# Altium schematic sheet Sheet1.SchDoc
size A; SheetNumber: 1; SheetTotal: 1
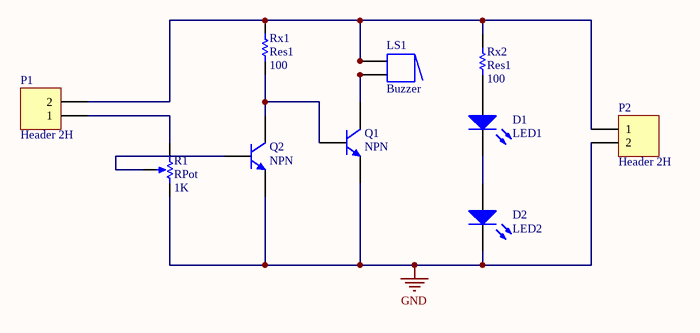
[diagram p0: Sheet1.SchDoc]

## Parts
D1  LED1  [LED-1]
D2  LED2  [LED-1]
LS1  Buzzer  [ABSM-1574]
P1  Header 2H  [HDR1X2H]
P2  Header 2H  [HDR1X2H]
Q1  NPN  [TO-226-AA]
Q2  NPN  [TO-226-AA]
R1  RPot  value 1K  [VR5]
Rx1  Res1  value 100  [AXIAL-0.1-RES]
Rx2  Res1  value 100  [AXIAL-0.1-RES]

## Nets
GND: D2.2(K) P2.2 Q1.3(E) Q2.3(E) R1.2(BOT)
NetD1_1: D1.1(A) Rx2.1
NetD1_2: D1.2(K) D2.1(A)
NetLS1_1: LS1.1 LS1.1A P1.2 P2.1 Rx1.2 Rx2.2
NetLS1_2: LS1.2 LS1.2A Q1.1(C)
NetP1_1: P1.1 R1.1(TOP)
NetQ1_2: Q1.2(B) Q2.1(C) Rx1.1
NetQ2_2: Q2.2(B) R1.3(TAP)

## Library data of the parts
D1 D2 = LED1: Typical RED GaAs LED; Published: 8-Jun-2000; LatestRevisionDate: 08-Jul-2005; LatestRevisionNote: Mech Layer 1 removed.; PackageReference: LED-1; Publisher: Altium Limited; PackageDescription: LED; 2 Leads
LS1 = Buzzer: Magnetic Transducer Buzzer; Published: 24-Mar-1999; LatestRevisionDate: 17-Dec-2003; LatestRevisionNote: Schematic revised, PCB Footprint replaced.; DatasheetVersion: 17-Dec-2003; PackageReference: ABSM-1574; Publisher: Altium Limited; PackageDescription: Magnetic Transducer Buzzer; ComponentLink1Description: Manufacturer Link; ComponentLink1URL: http://www.megastar.com/linecard/buzzmode/index.php
P1 P2 = Header 2H: Header, 2-Pin, Right Angle; LatestRevisionDate: 17-Jul-2002; LatestRevisionNote: Re-released for DXP Platform.; Publisher: Altium Limited
Q1 Q2 = NPN: NPN Bipolar Transistor; Published: 8-Jun-2000; LatestRevisionDate: 17-Jul-2002; LatestRevisionNote: Re-released for DXP Platform.; PackageReference: TO-226-AA; Publisher: Altium Limited; PackageDescription: TO, Flat Index; 3 In-Line, Axial Leads; Body Dia. 4.8mm; Leads 0.55 x 0.51 mm (max); Code_JEDEC: TO-226-AA
R1 = RPot: Potentiometer; Sim Note: Enter the Resistance value and the set point into parameter fields.; Set Position: 0.5; Published: 8-Jun-2000; LatestRevisionDate: 17-Jul-2002; LatestRevisionNote: Re-released for DXP Platform.; PackageReference: VR5; Publisher: Altium Limited; PackageDescription: Variable Resistor, Thru-Hole; 3 Leads
Rx1 Rx2 = RES 100 OHM 5% 1/4W AXIAL: Resistor; Manufacturer Part Number: CFR-25JB-52-100R; Designator: R?; Power Rating: 1/4W; Tolerance: 0.05; Published: 8-Jun-2000; LatestRevisionDate: 17-Jul-2002; LatestRevisionNote: Re-released for DXP Platform.; Publisher: Altium Limited